# EAGLE schematic EMS_V3 (EAGLE 7.6.0)
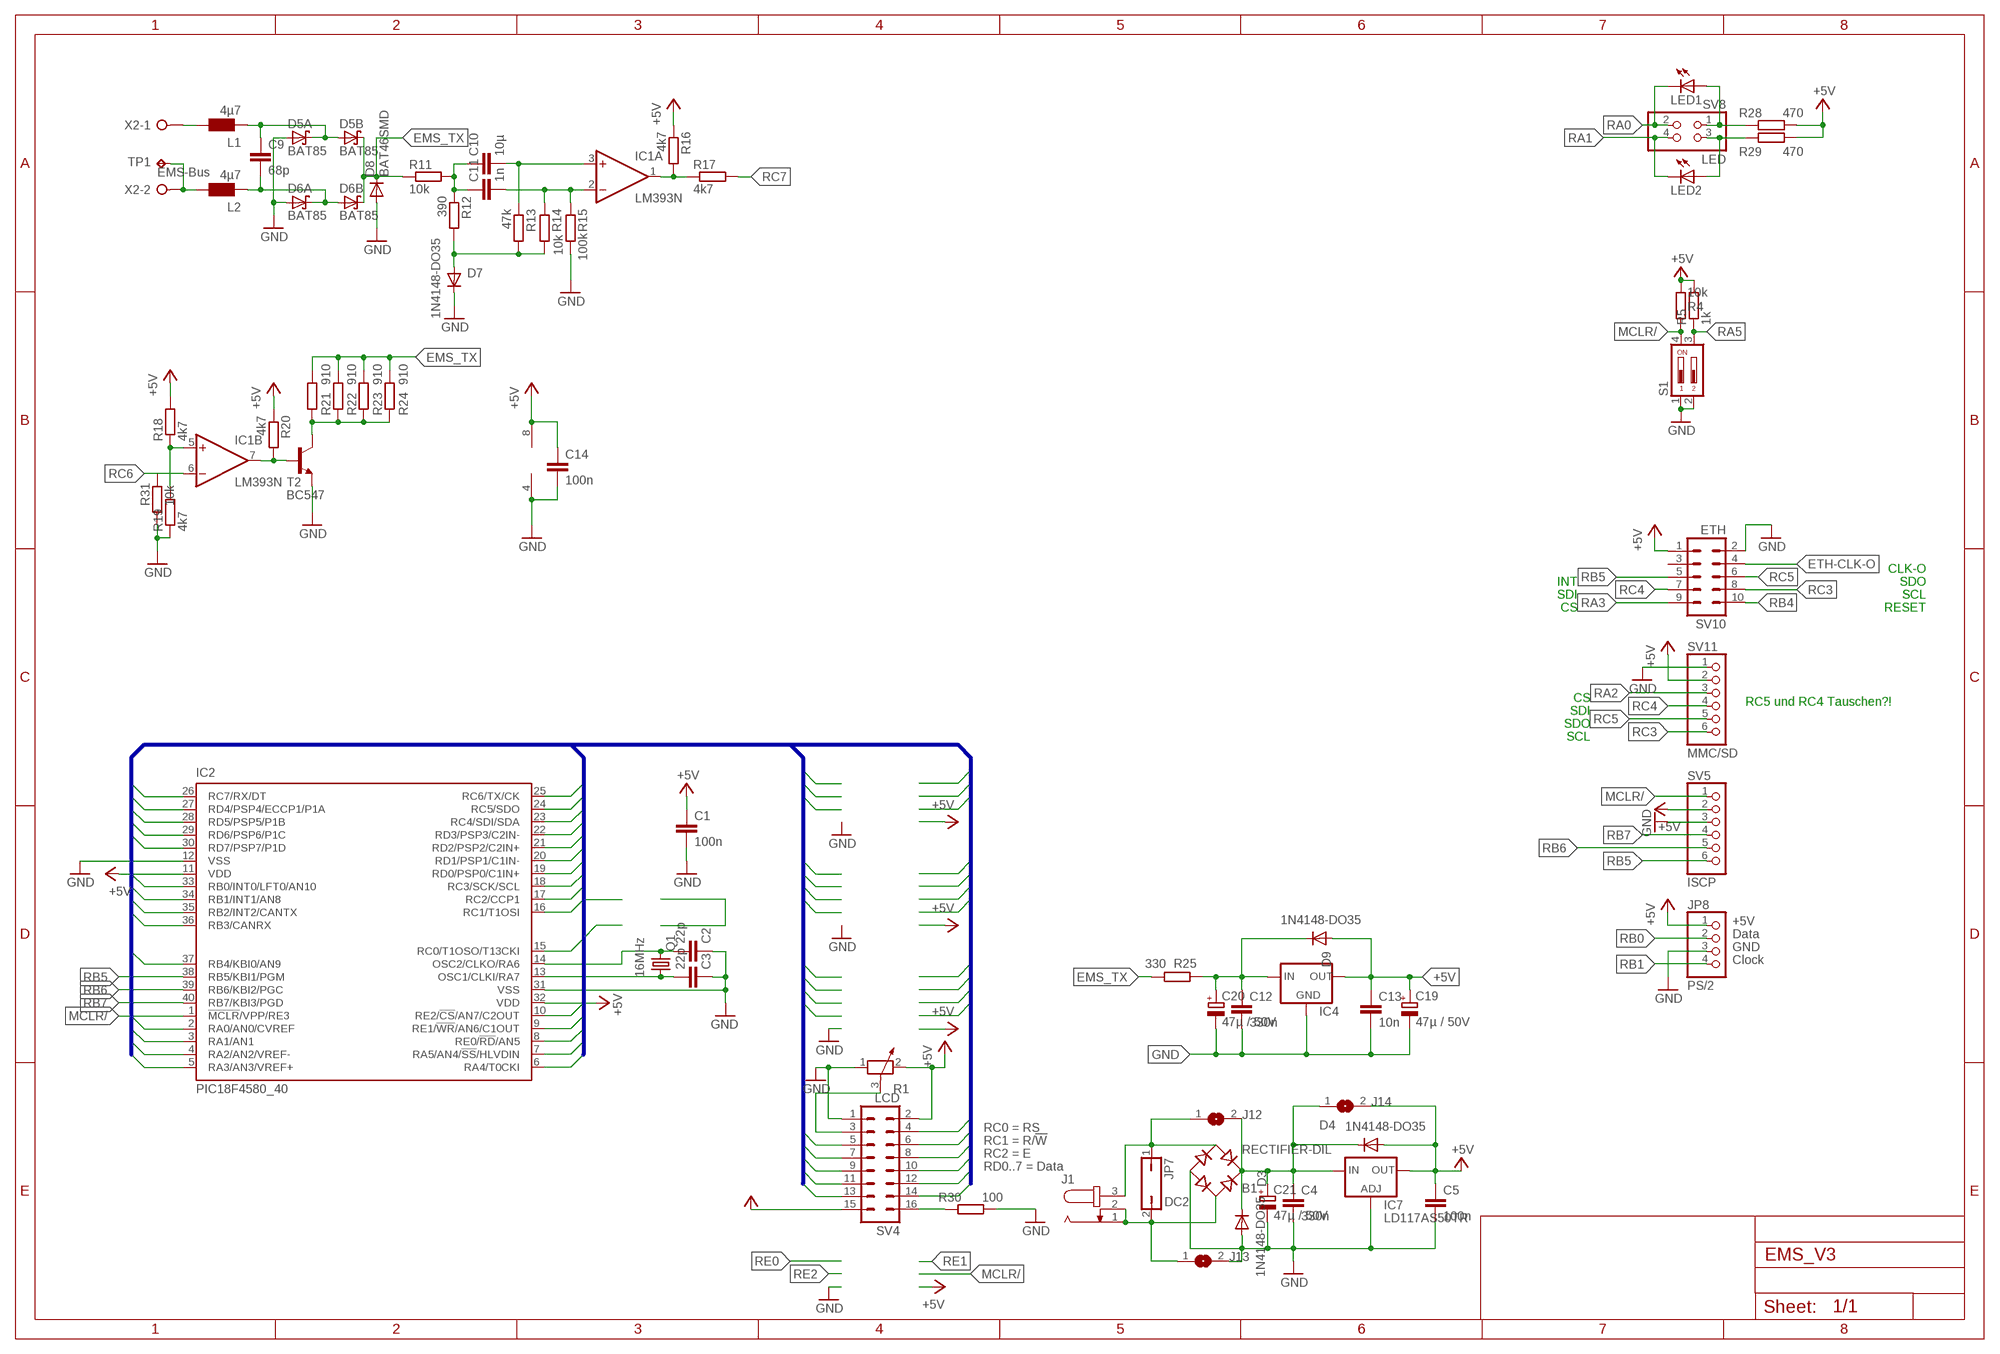
[diagram p0: schematic, sheet 1]

## Parts
B1  RECTIFIER-DIL  [B-DIL]
C1  100n  C-EU025-024X044  [C025-024X044]
C2  22p  C-EU025-024X044  [C025-024X044]
C3  22p  C-EU025-024X044  [C025-024X044]
C4  330n  C-EUC0805  [C0805]
C5  100n  C-EU025-024X044  [C025-024X044]
C9  68p  C-EUC0805  [C0805]
C10  10µ  C-EU050-075X075  [C050-075X075]
C11  1n  C-EU102-043X133  [C102-043X133]
C12  330n  C-EUC0805  [C0805]
C13  10n  C-EUC0805  [C0805]
C14  100n  C-EU025-024X044  [C025-024X044]
C19  47µ / 50V  CPOL-EUE2.5-7  [E2,5-7]
C20  47µ / 50V  CPOL-EUE2.5-7  [E2,5-7]
C21  47µ / 50V  CPOL-EUE2.5-7  [E2,5-7]
D3  1N4148-DO35  DIODE-D-2.5  [D-2.5]
D4  1N4148-DO35  DIODE-D-2.5  [D-2.5]
D5A  BAT85  [DO35-7]
D5B  BAT85  [DO35-7]
D6A  BAT85  [DO35-7]
D6B  BAT85  [DO35-7]
D7  1N4148-DO35  DIODE-D-2.5  [D-2.5]
D8  BAT46SMD  DIODE-D-2.5  [D-2.5]
D9  1N4148-DO35  DIODE-D-2.5  [D-2.5]
IC1  LM393N  [DIL08]
IC2  PIC18F4580_40  [DIL40]
IC4  78LXX  [78LXX]
IC7  LD117AS50TR  [SOT223]
J1  JACK-PLUG0  [SPC4077]
J12  SJ  [SJ]
J13  SJ  [SJ]
J14  SJ  [SJ]
JP7  DC2  JP1Q  [JP1]
JP8  PS/2  PINHD-1X4  [1X04]
L1  4µ7  WE-CBF_1210  [1210]
L2  4µ7  WE-CBF_1210  [1210]
LED1  LED3MM  [LED3MM]
LED2  LED3MM  [LED3MM]
Q1  16MHz  CRYSTALHC49S  [HC49/S]
R1  POTENTIOMETER_PT-10S  [PT-10S]
R4  10k  R-EU_0207/2V  [0207/2V]
R5  1k  R-EU_0207/2V  [0207/2V]
R11  10k  R-EU_0207/2V  [0207/2V]
R12  390  R-EU_0207/2V  [0207/2V]
R13  47k  R-EU_0207/2V  [0207/2V]
R14  10k  R-EU_0207/2V  [0207/2V]
R15  100k  R-EU_0207/2V  [0207/2V]
R16  4k7  R-EU_0207/2V  [0207/2V]
R17  4k7  R-EU_0207/2V  [0207/2V]
R18  4k7  R-EU_0207/2V  [0207/2V]
R19  4k7  R-EU_0207/2V  [0207/2V]
R20  4k7  R-EU_0207/2V  [0207/2V]
R21  910  R-EU_0207/2V  [0207/2V]
R22  910  R-EU_0207/2V  [0207/2V]
R23  910  R-EU_0207/2V  [0207/2V]
R24  910  R-EU_0207/2V  [0207/2V]
R25  330  R-EU_R0805  [R0805]
R28  470  R-EU_0207/2V  [0207/2V]
R29  470  R-EU_0207/2V  [0207/2V]
R30  100  R-EU_0207/2V  [0207/2V]
R31  10k  R-EU_0207/2V  [0207/2V]
S1  DP02  [DP-02]
SV4  LCD  MA08-2  [MA08-2]
SV5  ISCP  PINHD-1X6  [1X06]
SV8  LED  PINHD-2X2_2.54  [2X02]
SV10  ETH  MA05-2  [MA05-2]
SV11  MMC/SD  PINHD-1X6  [1X06]
T2  BC547  [TO92]
TP1  TPPAD1-13  [P1-13]
X2  EMS-Bus  W237-02P  [W237-132]

## Nets
+5V [Versorgung]: C1.1 C5.1 C13.1 C14.1 C19.+ D4.A D9.A IC1.8(P:V+) IC2.11(VDD) IC2.32(VDD) IC4.OUT IC7.4(OUT) J14.2 JP8.1 R1.2 R4.1 R5.2 R16.1 R18.2 R20.1 R28.1 R29.1 SV4.2 SV4.15 SV5.2 SV10.1 SV11.2
EMS_TX: D5B.C D6B.C D8.C R11.1 R21.1 R22.1 R23.1 R24.1 R25.1
ETH-CLK-O: SV10.4
GND [Versorgung]: B1.- C1.2 C2.1 C3.1 C4.2 C5.2 C12.2 C13.2 C14.2 C19.- C20.- C21.- D3.A D5A.A D6A.A D7.C D8.A IC1.4(P:V-) IC2.12(VSS) IC2.31(VSS) IC4.GND IC7.1(ADJ) J13.2 JP8.3 R1.1 R15.2 R19.1 R30.1 R31.2 S1.1 S1.2 SV4.1 SV5.3 SV10.2 SV11.1 T2.1(E)
MCLR/: IC2.1(!MCLR!/VPP/RE3) R4.2 S1.4 SV5.1
N$2: C2.2 IC2.14(OSC2/CLKO/RA6) Q1.2
N$3: C3.2 IC2.13(OSC1/CLKI/RA7) Q1.1
N$4: R1.3 SV4.3
N$5 [Versorgung]: B1.AC1 J1.1 J1.2 J13.1 JP7.2
N$6: C9.1 D5A.C D5B.A L1.1
N$7: L2.2 TP1.TP X2.2
N$8: L1.2 X2.1
N$9: C10.1 C11.1 R11.2 R12.1
N$10: D7.A R12.2 R13.2 R14.2
N$11: IC1.1(A:OUT) R16.2 R17.1
N$12: C10.2 IC1.3(A:+IN) R13.1
N$13: C11.2 IC1.2(A:-IN) R14.1 R15.1
N$14: C9.2 D6A.C D6B.A L2.1
N$18 [Versorgung]: C12.1 C20.+ D9.C IC4.IN R25.2
N$21: R21.2 R22.2 R23.2 R24.2 T2.3(C)
N$22: IC1.5(B:+IN) R18.1 R19.2
N$23: IC1.7(B:OUT) R20.2 T2.2(B)
N$34: B1.+ C4.1 C21.+ D3.C D4.C IC7.3(IN) J12.2 J14.1
N$41: LED1.A R28.2 SV8.1
N$42: LED2.A R29.2 SV8.3
N$45: R30.2 SV4.16
N$47 [Versorgung]: B1.AC2 J1.3 J12.1 JP7.1
RA0: IC2.2(RA0/AN0/CVREF) LED1.K(C) SV8.2
RA1: IC2.3(RA1/AN1) LED2.K(C) SV8.4
RA2: IC2.4(RA2/AN2/VREF-) SV11.3
RA3: IC2.5(RA3/AN3/VREF+) SV10.9
RA4: IC2.6(RA4/T0CKI)
RA5: IC2.7(RA5/AN4/!SS!/HLVDIN) R5.1 S1.3
RB0: IC2.33(RB0/INT0/LFT0/AN10) JP8.2
RB1: IC2.34(RB1/INT1/AN8) JP8.4
RB2: IC2.35(RB2/INT2/CANTX)
RB3: IC2.36(RB3/CANRX)
RB4: IC2.37(RB4/KBI0/AN9) SV10.10
RB5: IC2.38(RB5/KBI1/PGM) SV5.6 SV10.5
RB6: IC2.39(RB6/KBI2/PGC) SV5.5
RB7: IC2.40(RB7/KBI3/PGD) SV5.4
RC0: IC2.15(RC0/T1OSO/T13CKI) SV4.4
RC1: IC2.16(RC1/T1OSI) SV4.5
RC2: IC2.17(RC2/CCP1) SV4.6
RC3: IC2.18(RC3/SCK/SCL) SV10.8 SV11.6
RC4: IC2.23(RC4/SDI/SDA) SV10.7 SV11.4
RC5: IC2.24(RC5/SDO) SV10.6 SV11.5
RC6: IC1.6(B:-IN) IC2.25(RC6/TX/CK)
RC7: IC2.26(RC7/RX/DT) R17.2
RD0: IC2.19(RD0/PSP0/C1IN+) SV4.7
RD1: IC2.20(RD1/PSP1/C1IN-) SV4.8
RD2: IC2.21(RD2/PSP2/C2IN+) SV4.9
RD3: IC2.22(RD3/PSP3/C2IN-) SV4.10
RD4: IC2.27(RD4/PSP4/ECCP1/P1A) SV4.11
RD5: IC2.28(RD5/PSP5/P1B) SV4.12
RD6: IC2.29(RD6/PSP6/P1C) SV4.13
RD7: IC2.30(RD7/PSP7/P1D) SV4.14
RE0: IC2.8(RE0/!RD!/AN5)
RE1: IC2.9(RE1/!WR!/AN6/C1OUT)
RE2: IC2.10(RE2/!CS!/AN7/C2OUT)
Unconnected: R31.1 SV10.3

## Buses
PORTS:RA[0..5],RB[0..7],RC[0..7],RD[0..7],RE[0..2]

## Notes on the sheet
- CLK-O
- INT | SDO
- SDI | SCL
- CS | RESET
- CS
- SDI | RC5 und RC4 Tauschen?!
- SDO
- SCL
- +5V
- Data
- GND
- Clock
- RC0 = RS
- RC1 = R/!W!
- RC2 = E
- RD0..7 = Data

## Library data of the parts
B1 = rectifier:RECTIFIER-: Rectifier
C1-C5 C9-C14 = rcl:C-EU: CAPACITOR, European symbol
C19-C21 = rcl:CPOL-EU: POLARIZED CAPACITOR, European symbol
D3 D4 D7-D9 = diode:DIODE-: DIODE
D5A D5B D6A D6B = mod2_diode:BAT85: DIODE Schottky Diode
IC1 = linear:LM393: COMPARATOR
IC2 = microchip_mod_neu:PIC18F4580_40: Enhanced Flash Microcontrollers with ECAN Technology 10-Bit A/D an nanoWatt Technology Source: http://ww1.microchip.com/downloads/en/devicedoc/39637c.pdf
IC4 = v-reg:78LXX: VOLTAGE REGULATOR
IC7 = v-reg:LD117A?*: Low drop fixed and adjustable positive voltage regulators 1 A Source: http://www.st.com/stonline/products/literature/ds/7194/ld1117axx.pdf
J1 = con-dc:JACK-PLUG: DC POWER JACK Power Jack, DC, Right Angle, Through Hole, Rated 5A at 16VDC, PC Terminals Distributor: Farnell (www.Farnell.de) Drawing: 84N1161.pdf / 84N1162.pdf Manufacturer: SPC Technology (www.spctechnology.com) Type: SPC4077 / SPC 4078; OC_FARNELL: unknown; OC_NEWARK: unknown
J12-J14 = jumper:SJ: SMD solder JUMPER
JP7 = jumper:JP1Q: JUMPER
JP8 = pinhead:PINHD-1X4: PIN HEADER
L1 L2 = wuerth-elektronik:WE-CBF: SMD EMI Suppression Ferrite Beads - excellent anti-EMI properties - low DCR - impedances till 3000 ohms - rated current up to 6 A
LED1 LED2 = led:LED: LED OSRAM: - CHIPLED LG R971, LG N971, LY N971, LG Q971, LY Q971, LO R971, LY R971 LH N974, LH R974 LS Q976, LO Q976, LY Q976 LO Q996 - Hyper CHIPLED LW Q18S LB Q993, LB Q99A, LB R99A - SideLED LS A670, LO A670, LY A670, LG A670, LP A670 LB A673, LV A673, LT A673, LW A673 LH A674 LY A675 LS A676, LA A676, LO A676, LY A676, LW A676 LS A679, LY A679, LG A679 - Hyper Micro SIDELED® LS Y876, LA Y876, LO Y876, LY Y876 LT Y87S - SmartLED LW L88C, LW L88S LB L89C, LB L89S, LG L890 LS L89K, LO L89K, LY L89K LS L896, LA L896, LO L896, LY L896 - TOPLED LS T670, LO T670, LY T670, LG T670, LP T670 LSG T670, LSP T670, LSY T670, LOP T670, LYG T670 LG T671, LOG T671, LSG T671 LB T673, LV T673, LT T673, LW T673 LH T674 LS T676, LA T676, LO T676, LY T676, LB T676, LH T676, LSB T676, LW T676 LB T67C, LV T67C, LT T67C, LS T67K, LO T67K, LY T67K, LW E67C LS E67B, LA E67B, LO E67B, LY E67B, LB E67C, LV E67C, LT E67C LW T67C LS T679, LY T679, LG T679 LS T770, LO T770, LY T770, LG T770, LP T770 LB T773, LV T773, LT T773, LW T773 LH T774 LS E675, LA E675, LY E675, LS T675 LS T776, LA T776, LO T776, LY T776, LB T776 LHGB T686 LT T68C, LB T68C - Hyper Mini TOPLED® LB M676 - Mini TOPLED Santana® LG M470 LS M47K, LO M47K, LY M47K Source: http://www.osram.convergy.de LUXEON: - LUMILED® LXK2-PW12-R00, LXK2-PW12-S00, LXK2-PW14-U00, LXK2-PW14-V00 LXK2-PM12-R00, LXK2-PM12-S00, LXK2-PM14-U00 LXK2-PE12-Q00, LXK2-PE12-R00, LXK2-PE12-S00, LXK2-PE14-T00, LXK2-PE14-U00 LXK2-PB12-K00, LXK2-PB12-L00, LXK2-PB12-M00, LXK2-PB14-N00, LXK2-PB14-P00, LXK2-PB14-Q00 LXK2-PR12-L00, LXK2-PR12-M00, LXK2-PR14-Q00, LXK2-PR14-R00 LXK2-PD12-Q00, LXK2-PD12-R00, LXK2-PD12-S00 LXK2-PH12-R00, LXK2-PH12-S00 LXK2-PL12-P00, LXK2-PL12-Q00, LXK2-PL12-R00 Source: www.luxeon.com KINGBRIGHT: KA-3528ASYC Source: www.kingbright.com
Q1 = crystal:CRYSTAL: CRYSTAL; OC_FARNELL: 1667008; OC_NEWARK: unknown
R1 = rcl:POTENTIOMETER_: Potentiometer
R4 R5 R11-R25 R28-R31 = resistor:R-EU_: RESISTOR, European symbol
S1 = switch-dil:DP02: DIL/CODE SWITCH; MPN: MCDP02; OC_FARNELL: 1255233; OC_NEWARK: 26M1095
SV4 = con-lstb:MA08-2: PIN HEADER; OC_FARNELL: unknown; OC_NEWARK: unknown
SV5 SV11 = pinhead:PINHD-1X6: PIN HEADER
SV8 = pinhead:PINHD-2X2: PIN HEADER
SV10 = con-lstb:MA05-2: PIN HEADER; OC_FARNELL: unknown; OC_NEWARK: unknown
T2 = transistor:BC547: NPN TRANSISTOR
TP1 = testpad:TP: Test pad
X2 = con-wago-508:W237-02P: WAGO SREW CLAMP; OC_FARNELL: unknown; OC_NEWARK: unknown

## Net classes
0 default: width 0.356 mm, clearance 0.15 mm
1 Versorgung: width 0.914 mm, clearance 0.15 mm